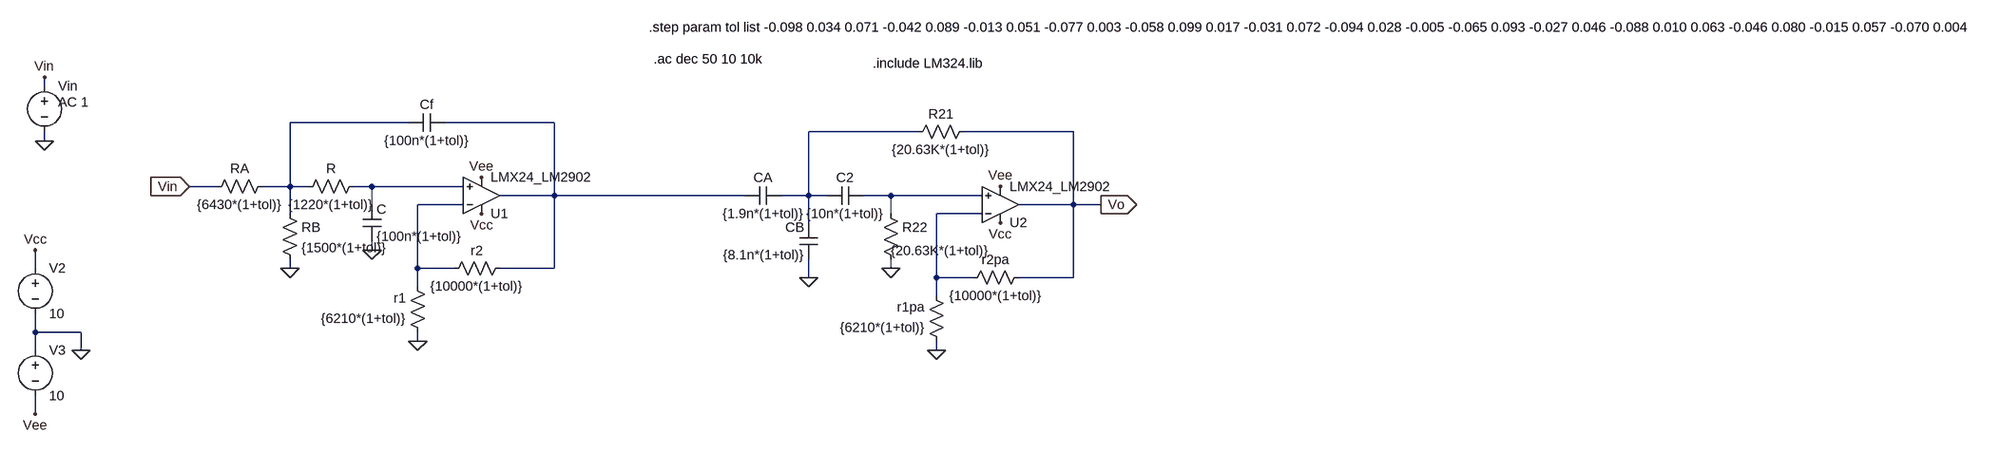
[diagram p0: schematic circuitoPasabandaMonte.asc]
circuitoPasabandaMonte.asc, the LTspice schematic file:
Version 4.1
SHEET 1 2824 680
WIRE -864 -160 -864 -176
WIRE -224 -96 -432 -96
WIRE 32 -96 -160 -96
WIRE 768 -80 576 -80
WIRE 1040 -80 848 -80
WIRE -864 -64 -864 -80
WIRE -560 16 -608 16
WIRE -432 16 -432 -96
WIRE -432 16 -480 16
WIRE -400 16 -432 16
WIRE -288 16 -320 16
WIRE -128 16 -288 16
WIRE 32 32 32 -96
WIRE 32 32 -64 32
WIRE 464 32 32 32
WIRE 576 32 576 -80
WIRE 576 32 528 32
WIRE 608 32 576 32
WIRE 720 32 672 32
WIRE 880 32 720 32
WIRE -288 48 -288 16
WIRE -128 48 -208 48
WIRE 1040 48 1040 -80
WIRE 1040 48 944 48
WIRE 1088 48 1040 48
WIRE -432 64 -432 16
WIRE 720 64 720 32
WIRE 880 64 800 64
WIRE 576 80 576 32
WIRE -288 128 -288 112
WIRE -880 160 -880 128
WIRE -432 160 -432 144
WIRE -208 160 -208 48
WIRE -144 160 -208 160
WIRE 32 160 32 32
WIRE 32 160 -64 160
WIRE 720 160 720 144
WIRE 576 176 576 144
WIRE 800 176 800 64
WIRE 864 176 800 176
WIRE 1040 176 1040 48
WIRE 1040 176 944 176
WIRE -208 192 -208 160
WIRE 800 208 800 176
WIRE -880 272 -880 240
WIRE -800 272 -880 272
WIRE -208 288 -208 272
WIRE -880 304 -880 272
WIRE -800 304 -800 272
WIRE 800 304 800 288
WIRE -880 416 -880 384
FLAG -288 128 0
FLAG -208 288 0
FLAG -608 16 Vin
IOPIN -608 16 In
FLAG -432 160 0
FLAG -96 64 Vcc
FLAG -96 0 Vee
FLAG 720 160 0
FLAG 800 304 0
FLAG 1088 48 Vo
IOPIN 1088 48 Out
FLAG 576 176 0
FLAG 912 80 Vcc
FLAG 912 16 Vee
FLAG -864 -64 0
FLAG -800 304 0
FLAG -864 -176 Vin
FLAG -880 416 Vee
FLAG -880 128 Vcc
SYMBOL res -464 0 R90
WINDOW 0 0 56 VBottom 2
WINDOW 3 32 56 VTop 2
SYMATTR InstName RA
SYMATTR Value {6430*(1+tol)}
SYMBOL res -304 0 R90
WINDOW 0 0 56 VBottom 2
WINDOW 3 32 56 VTop 2
SYMATTR InstName R
SYMATTR Value {1220*(1+tol)}
SYMBOL res -48 144 R90
WINDOW 0 0 56 VBottom 2
WINDOW 3 32 56 VTop 2
SYMATTR InstName r2
SYMATTR Value {10000*(1+tol)}
SYMBOL res -192 288 R180
WINDOW 0 36 76 Left 2
WINDOW 3 36 40 Left 2
SYMATTR InstName r1
SYMATTR Value {6210*(1+tol)}
SYMBOL cap -304 48 R0
SYMATTR InstName C
SYMATTR Value {100n*(1+tol)}
SYMBOL cap -160 -112 R90
WINDOW 0 0 32 VBottom 2
WINDOW 3 32 32 VTop 2
SYMATTR InstName Cf
SYMATTR Value {100n*(1+tol)}
SYMBOL res -448 48 R0
SYMATTR InstName RB
SYMATTR Value {1500*(1+tol)}
SYMBOL res 960 160 R90
WINDOW 0 0 56 VBottom 2
WINDOW 3 32 56 VTop 2
SYMATTR InstName r2pa
SYMATTR Value {10000*(1+tol)}
SYMBOL res 816 304 R180
WINDOW 0 36 76 Left 2
WINDOW 3 36 40 Left 2
SYMATTR InstName r1pa
SYMATTR Value {6210*(1+tol)}
SYMBOL cap 528 16 R90
WINDOW 0 0 32 VBottom 2
WINDOW 3 32 32 VTop 2
SYMATTR InstName CA
SYMATTR Value {1.9n*(1+tol)}
SYMBOL cap 672 16 R90
WINDOW 0 0 32 VBottom 2
WINDOW 3 32 32 VTop 2
SYMATTR InstName C2
SYMATTR Value {10n*(1+tol)}
SYMBOL cap 592 144 R180
WINDOW 0 24 56 Left 2
WINDOW 3 24 8 Left 2
SYMATTR InstName CB
SYMATTR Value {8.1n*(1+tol)}
SYMBOL res 704 48 R0
WINDOW 3 16 81 Left 2
SYMATTR Value {20.63K*(1+tol)}
SYMATTR InstName R22
SYMBOL res 864 -96 R90
WINDOW 0 0 56 VBottom 2
WINDOW 3 32 56 VTop 2
SYMATTR InstName R21
SYMATTR Value {20.63K*(1+tol)}
SYMBOL OpAmps\\opamp2 -96 96 M180
SYMATTR InstName U1
SYMATTR Value LMX24_LM2902
SYMBOL OpAmps\\opamp2 912 112 M180
SYMATTR InstName U2
SYMATTR Value LMX24_LM2902
SYMBOL voltage -864 -176 R0
WINDOW 123 24 44 Left 2
WINDOW 39 0 0 Left 0
SYMATTR Value2 AC 1
SYMATTR InstName Vin
SYMATTR Value ""
SYMBOL voltage -880 144 R0
WINDOW 123 0 0 Left 0
WINDOW 39 0 0 Left 0
SYMATTR InstName V2
SYMATTR Value 10
SYMBOL voltage -880 288 R0
WINDOW 123 0 0 Left 0
WINDOW 39 0 0 Left 0
SYMATTR InstName V3
SYMATTR Value 10
TEXT 688 -200 Left 2 !.include LM324.lib
TEXT 304 -208 Left 2 !.ac dec 50 10 10k
TEXT 296 -264 Left 2 !.step param tol list -0.098 0.034 0.071 -0.042 0.089 -0.013 0.051 -0.077 0.003 -0.058 0.099 0.017 -0.031 0.072 -0.094 0.028 -0.005 -0.065 0.093 -0.027 0.046 -0.088 0.010 0.063 -0.046 0.080 -0.015 0.057 -0.070 0.004

The netlist it stands for:
* circuitoPasabandaMonte.asc
RA N001 Vin {6430*(1+tol)}
R N004 N001 {1220*(1+tol)}
r2 N002 N006 {10000*(1+tol)}
r1 0 N006 {6210*(1+tol)}
C N004 0 {100n*(1+tol)}
Cf N002 N001 {100n*(1+tol)}
RB N001 0 {1500*(1+tol)}
r2pa Vo N007 {10000*(1+tol)}
r1pa 0 N007 {6210*(1+tol)}
CA N003 N002 {1.9n*(1+tol)}
C2 N005 N003 {10n*(1+tol)}
CB 0 N003 {8.1n*(1+tol)}
R22 N005 0 {20.63K*(1+tol)}
R21 Vo N003 {20.63K*(1+tol)}
X§U1 N004 N006 Vcc Vee N002 LMX24_LM2902  ; pins In+ In- V+ V- OUT
X§U2 N005 N007 Vcc Vee Vo LMX24_LM2902  ; pins In+ In- V+ V- OUT
Vin Vin 0 AC 1
V2 Vcc 0 10
V3 0 Vee 10
.include LM324.lib
.ac dec 50 10 10k
.step param tol list -0.098 0.034 0.071 -0.042 0.089 -0.013 0.051 -0.077 0.003 -0.058 0.099 0.017 -0.031 0.072 -0.094 0.028 -0.005 -0.065 0.093 -0.027 0.046 -0.088 0.010 0.063 -0.046 0.080 -0.015 0.057 -0.070 0.004
.backanno
.end